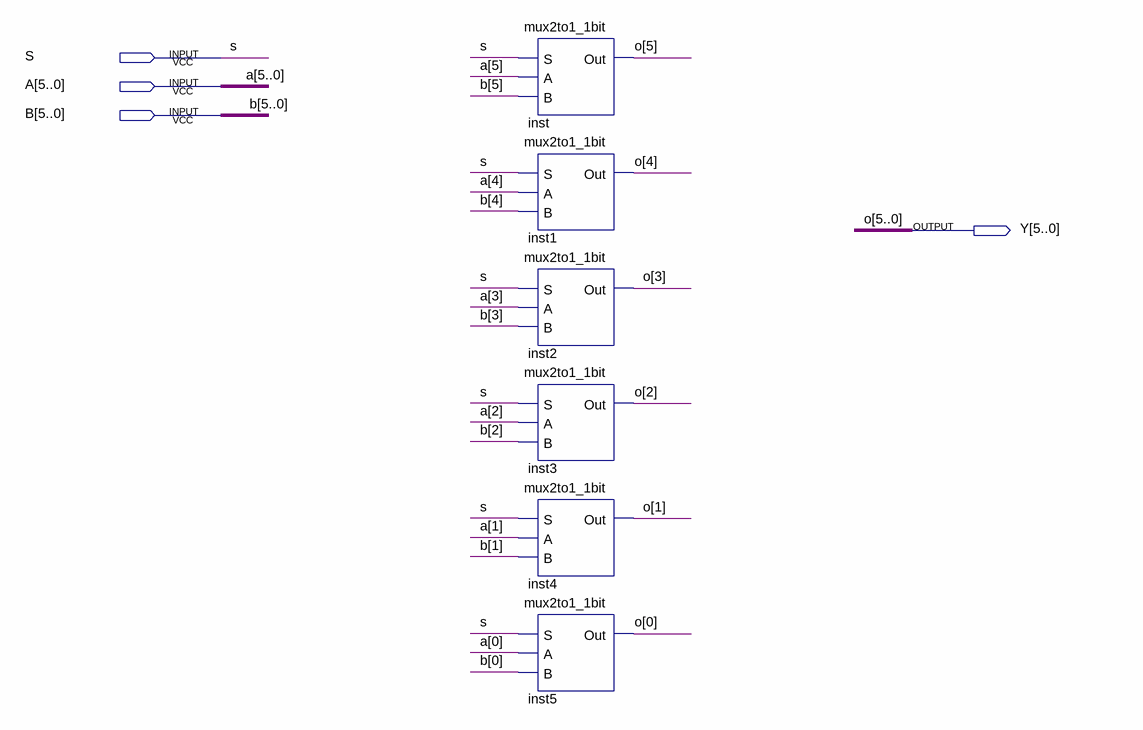
[diagram p0: schematic sheet]
// Quartus schematic mux2to1_6bit.bdf as structural Verilog: 6 symbols, 4 pins
module mux2to1_6bit (
  input  S,
  input  [5:0] A,
  input  [5:0] B,
  output [5:0] Y
);

  mux2to1_1bit inst (.S(S), .A(A[5]), .B(B[5]), .Out(Y[5]));
  mux2to1_1bit inst1 (.S(S), .A(A[4]), .B(B[4]), .Out(Y[4]));
  mux2to1_1bit inst2 (.S(S), .A(A[3]), .B(B[3]), .Out(Y[3]));
  mux2to1_1bit inst3 (.S(S), .A(A[2]), .B(B[2]), .Out(Y[2]));
  mux2to1_1bit inst4 (.S(S), .A(A[1]), .B(B[1]), .Out(Y[1]));
  mux2to1_1bit inst5 (.S(S), .A(A[0]), .B(B[0]), .Out(Y[0]));

  // Other names for the same wires on the sheet: o[5:0] = Y
endmodule
